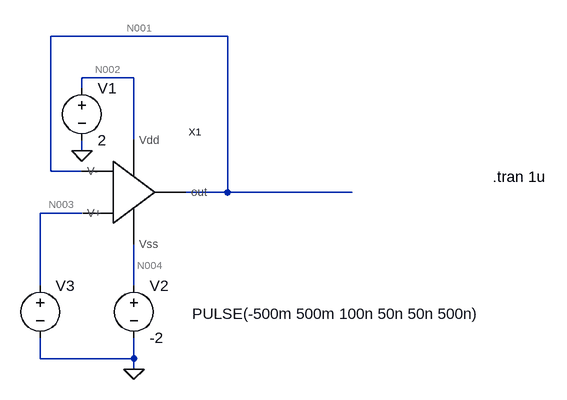
[diagram p0: schematic Draft1.asc]
Draft1.asc, the LTspice schematic file:
Version 4
SHEET 1 880 680
WIRE 160 -80 -112 -80
WIRE 16 -16 -64 -16
WIRE -64 0 -64 -16
WIRE 16 80 16 -16
WIRE -64 96 -64 80
WIRE -112 128 -112 -80
WIRE -64 128 -112 128
WIRE 160 160 160 -80
WIRE 160 160 96 160
WIRE 352 160 160 160
WIRE -64 192 -128 192
WIRE -128 304 -128 192
WIRE 16 304 16 240
WIRE -128 416 -128 384
WIRE 16 416 16 384
WIRE 16 416 -128 416
WIRE 16 432 16 416
FLAG -64 96 0
FLAG 16 432 0
SYMBOL voltage -64 -16 R0
WINDOW 123 0 0 Left 0
WINDOW 39 0 0 Left 0
SYMATTR InstName V1
SYMATTR Value 2
SYMBOL voltage 16 288 R0
WINDOW 123 0 0 Left 0
WINDOW 39 0 0 Left 0
SYMATTR InstName V2
SYMATTR Value -2
SYMBOL voltage -128 288 R0
WINDOW 123 0 0 Left 0
WINDOW 39 0 0 Left 0
WINDOW 3 234 59 Left 2
SYMATTR Value PULSE(-500m 500m 100n 50n 50n 500n)
SYMATTR InstName V3
SYMBOL OPAMP -96 160 R0
SYMATTR InstName X1
TEXT 568 136 Left 2 !.tran 1u

The netlist it stands for:
* Draft1.asc
V1 N002 0 2
V2 N004 0 -2
V3 N003 0 PULSE(-500m 500m 100n 50n 50n 500n)
XX1 N002 N004 N001 N003 N001 OPAMP  ; pins Vdd Vss V- V+ out
.tran 1u
.backanno
.end

* Results of the author's LTspice run, read from the files saved beside the schematic
* Operating Point, zero values left out:
*   V(n002) = 2 V
*   V(n004) = -2 V
*   V(n003) = -500 mV
*   V(n001) = -500 mV
*   I(V1) = -180.6 µA
*   I(V2) = 180.6 µA
*   Ix(x1:VDD) = 180.6 µA
*   Ix(x1:VSS) = -180.6 µA
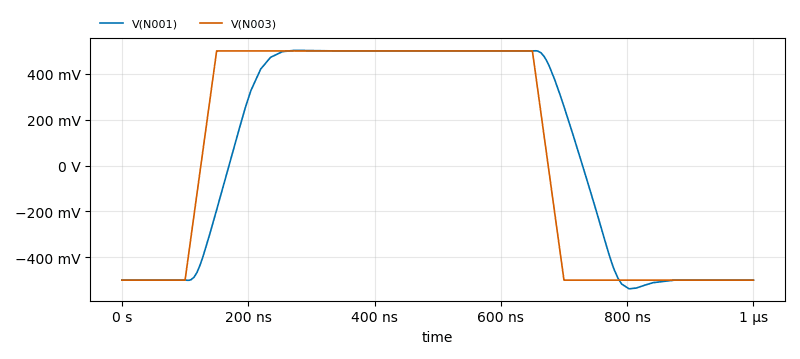
[diagram p1: Transient Analysis of Draft1.asc, plotted from the saved traces]
* Transient Analysis, 1 run:
*   V(N001): min -537.8 mV, max 502.5 mV, average 55.72 mV, rms 462.3 mV, last -500 mV
*   V(N003): min -500 mV, max 500 mV, average 50 mV, rms 483.4 mV, last -500 mV